# Altium schematic sheet Page04 CPU PWR.SchDoc
size 513 x 386 mm
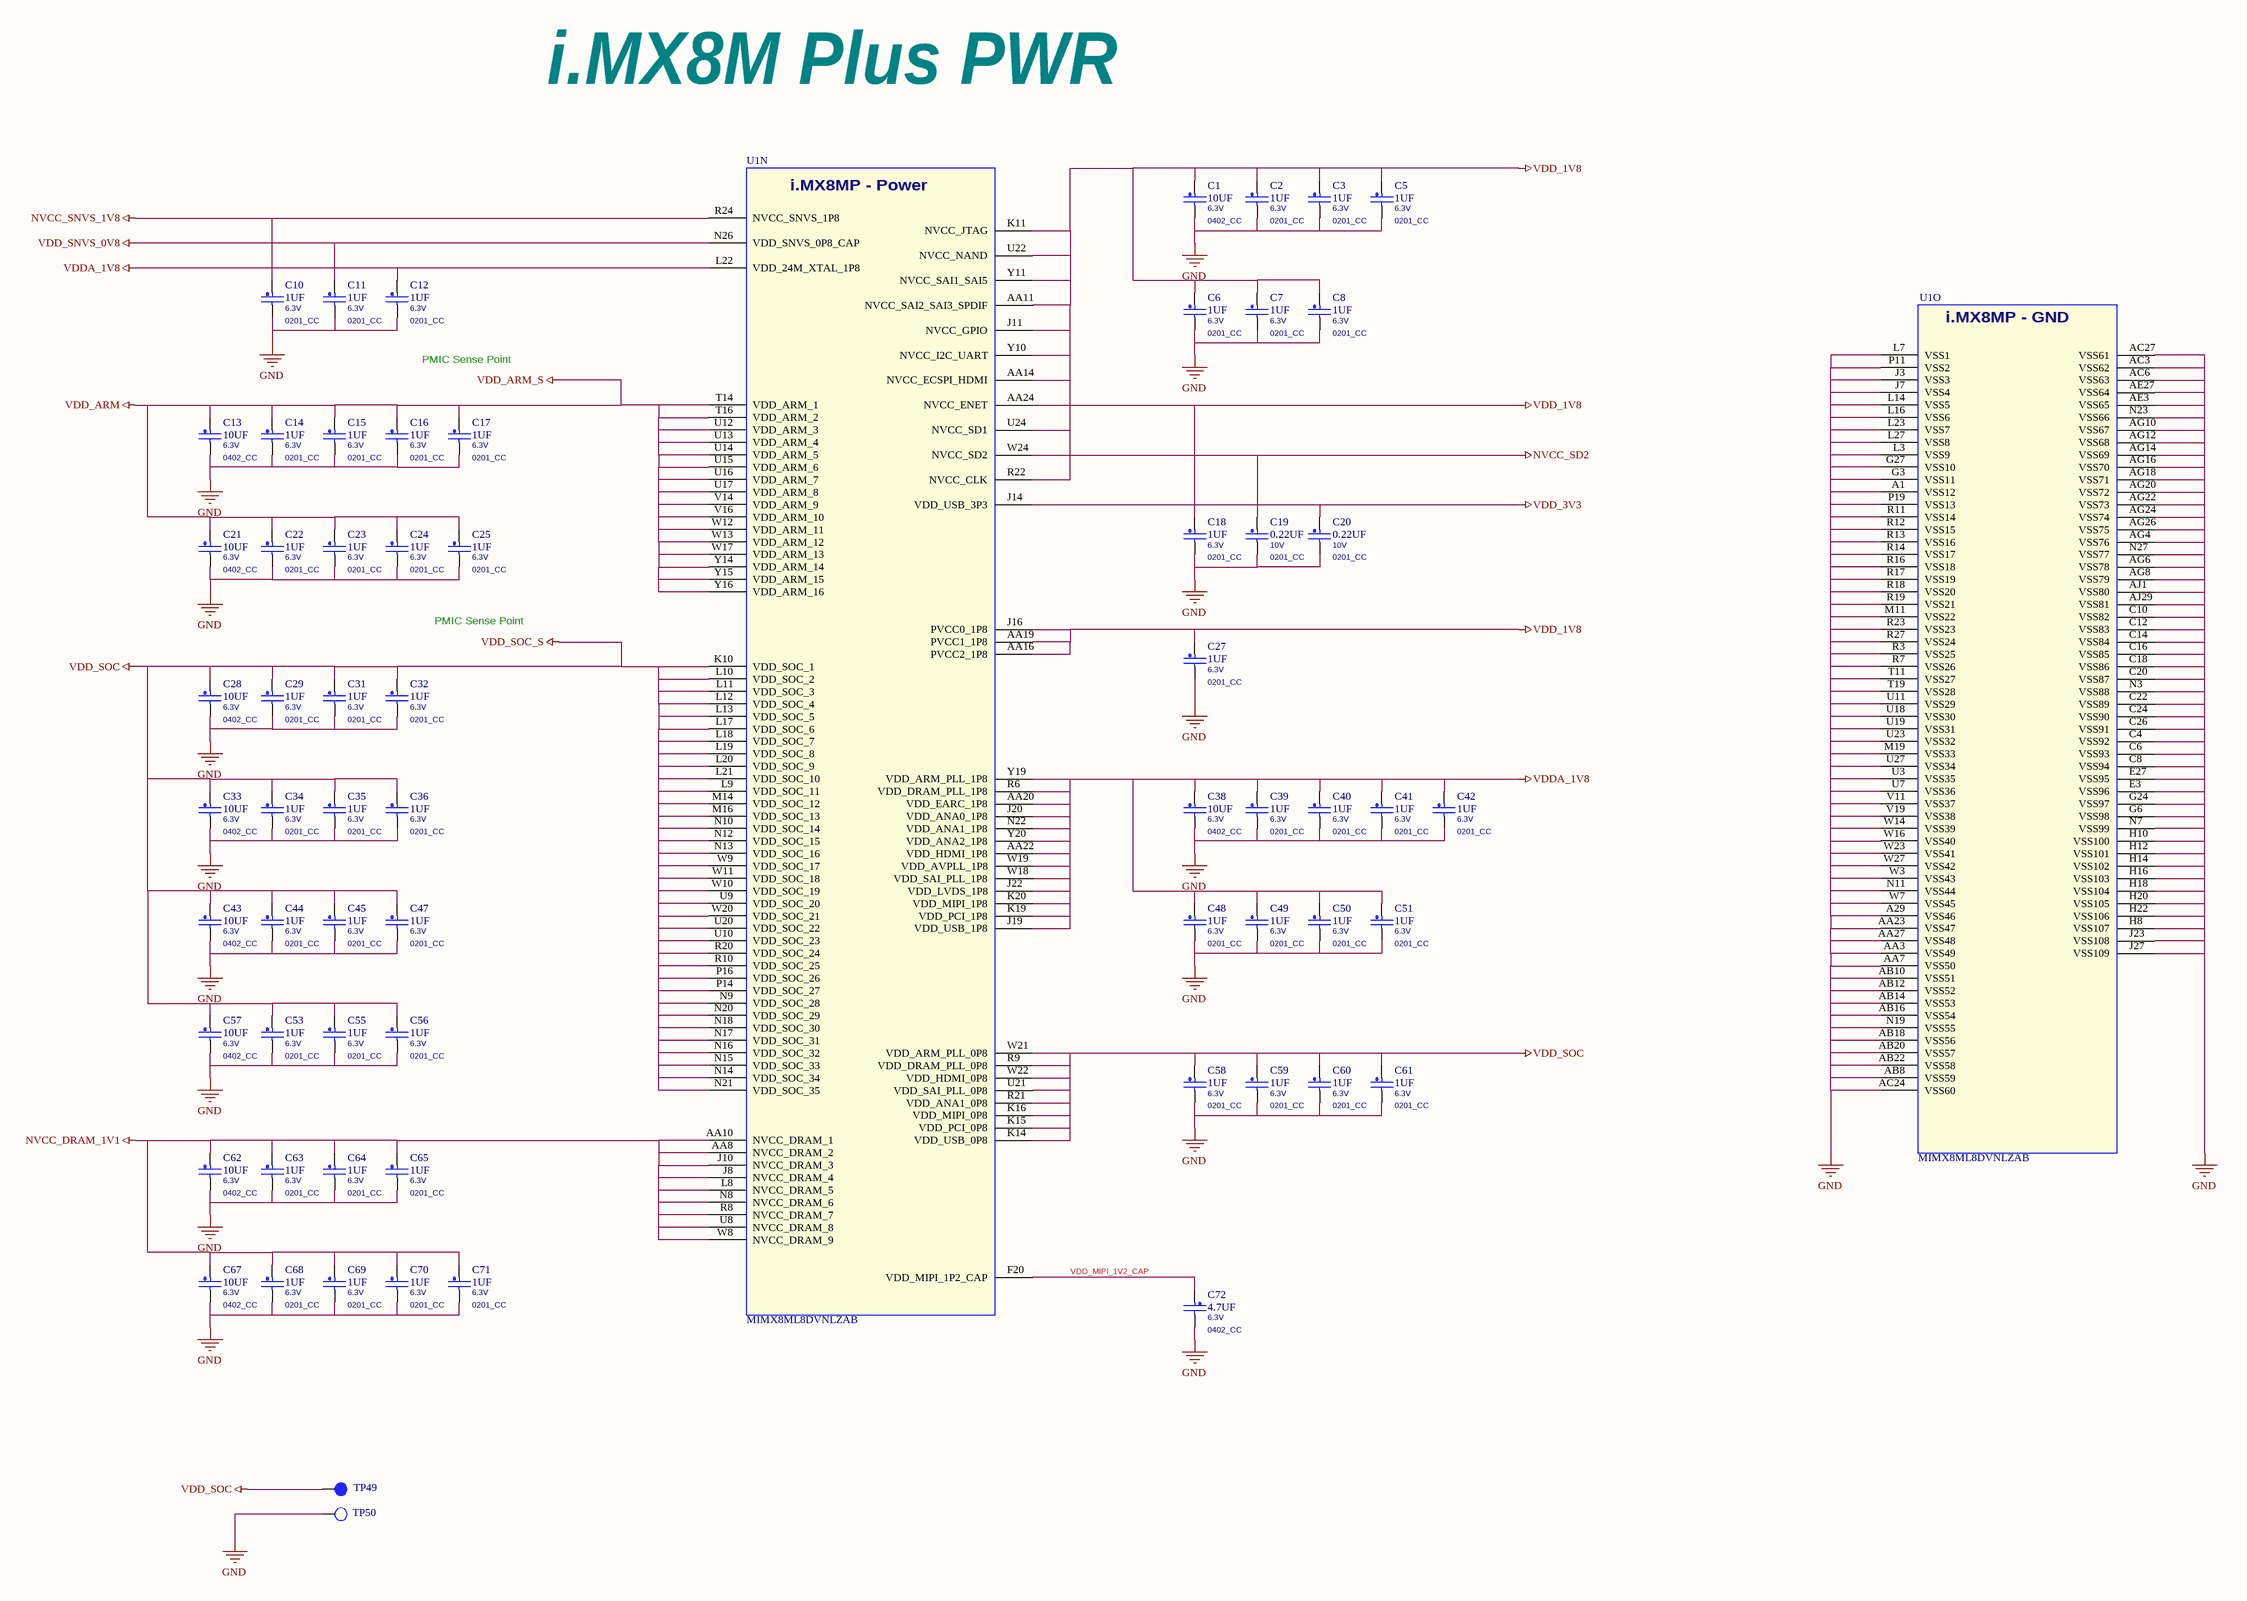
[diagram p0: Page04 CPU PWR.SchDoc]

## Parts
C1  10UF  VOLTAGE: 6.3V  [0402_CC]
C2  1UF  VOLTAGE: 6.3V  [0201_CC]
C3  1UF  VOLTAGE: 6.3V  [0201_CC]
C5  1UF  VOLTAGE: 6.3V  [0201_CC]
C6  1UF  VOLTAGE: 6.3V  [0201_CC]
C7  1UF  VOLTAGE: 6.3V  [0201_CC]
C8  1UF  VOLTAGE: 6.3V  [0201_CC]
C10  1UF  VOLTAGE: 6.3V  [0201_CC]
C11  1UF  VOLTAGE: 6.3V  [0201_CC]
C12  1UF  VOLTAGE: 6.3V  [0201_CC]
C13  10UF  VOLTAGE: 6.3V  [0402_CC]
C14  1UF  VOLTAGE: 6.3V  [0201_CC]
C15  1UF  VOLTAGE: 6.3V  [0201_CC]
C16  1UF  VOLTAGE: 6.3V  [0201_CC]
C17  1UF  VOLTAGE: 6.3V  [0201_CC]
C18  1UF  VOLTAGE: 6.3V  [0201_CC]
C19  0.22UF  VOLTAGE: 10V  [0201_CC]
C20  0.22UF  VOLTAGE: 10V  [0201_CC]
C21  10UF  VOLTAGE: 6.3V  [0402_CC]
C22  1UF  VOLTAGE: 6.3V  [0201_CC]
C23  1UF  VOLTAGE: 6.3V  [0201_CC]
C24  1UF  VOLTAGE: 6.3V  [0201_CC]
C25  1UF  VOLTAGE: 6.3V  [0201_CC]
C27  1UF  VOLTAGE: 6.3V  [0201_CC]
C28  10UF  VOLTAGE: 6.3V  [0402_CC]
C29  1UF  VOLTAGE: 6.3V  [0201_CC]
C31  1UF  VOLTAGE: 6.3V  [0201_CC]
C32  1UF  VOLTAGE: 6.3V  [0201_CC]
C33  10UF  VOLTAGE: 6.3V  [0402_CC]
C34  1UF  VOLTAGE: 6.3V  [0201_CC]
C35  1UF  VOLTAGE: 6.3V  [0201_CC]
C36  1UF  VOLTAGE: 6.3V  [0201_CC]
C38  10UF  VOLTAGE: 6.3V  [0402_CC]
C39  1UF  VOLTAGE: 6.3V  [0201_CC]
C40  1UF  VOLTAGE: 6.3V  [0201_CC]
C41  1UF  VOLTAGE: 6.3V  [0201_CC]
C42  1UF  VOLTAGE: 6.3V  [0201_CC]
C43  10UF  VOLTAGE: 6.3V  [0402_CC]
C44  1UF  VOLTAGE: 6.3V  [0201_CC]
C45  1UF  VOLTAGE: 6.3V  [0201_CC]
C47  1UF  VOLTAGE: 6.3V  [0201_CC]
C48  1UF  VOLTAGE: 6.3V  [0201_CC]
C49  1UF  VOLTAGE: 6.3V  [0201_CC]
C50  1UF  VOLTAGE: 6.3V  [0201_CC]
C51  1UF  VOLTAGE: 6.3V  [0201_CC]
C53  1UF  VOLTAGE: 6.3V  [0201_CC]
C55  1UF  VOLTAGE: 6.3V  [0201_CC]
C56  1UF  VOLTAGE: 6.3V  [0201_CC]
C57  10UF  VOLTAGE: 6.3V  [0402_CC]
C58  1UF  VOLTAGE: 6.3V  [0201_CC]
C59  1UF  VOLTAGE: 6.3V  [0201_CC]
C60  1UF  VOLTAGE: 6.3V  [0201_CC]
C61  1UF  VOLTAGE: 6.3V  [0201_CC]
C62  10UF  VOLTAGE: 6.3V  [0402_CC]
C63  1UF  VOLTAGE: 6.3V  [0201_CC]
C64  1UF  VOLTAGE: 6.3V  [0201_CC]
C65  1UF  VOLTAGE: 6.3V  [0201_CC]
C67  10UF  VOLTAGE: 6.3V  [0402_CC]
C68  1UF  VOLTAGE: 6.3V  [0201_CC]
C69  1UF  VOLTAGE: 6.3V  [0201_CC]
C70  1UF  VOLTAGE: 6.3V  [0201_CC]
C71  1UF  VOLTAGE: 6.3V  [0201_CC]
C72  4.7UF  voltage rating: 6.3V  [0402_CC]
TP49  tpad_020  [tpad_020]  (value not drawn)
TP50  TP_35MIL  [testpoint_35mil]  (value not drawn)
U1  MIMX8ML8DVNLZAB  [BGA_M865S_0P5_15X15-BMS]  (parts N,O of 15)

## Nets
GND: C1.2 C2.2 C3.2 C5.2 C6.2 C7.2 C8.2 C10.2 C11.2 C12.2 C13.2 C14.2 C15.2 C16.2 C17.2 C18.2 C19.2 C20.2 C21.2 C22.2 C23.2 C24.2 C25.2 C27.2 C28.2 C29.2 C31.2 C32.2 C33.2 C34.2 C35.2 C36.2 C38.2 C39.2 C40.2 C41.2 C42.2 C43.2 C44.2 C45.2 C47.2 C48.2 C49.2 C50.2 C51.2 C53.2 C55.2 C56.2 C57.2 C58.2 C59.2 C60.2 C61.2 C62.2 C63.2 C64.2 C65.2 C67.2 C68.2 C69.2 C70.2 C71.2 C72.2 TP50.1(TP) U1.A1(VSS12) U1.A29(VSS46) U1.AA3(VSS49) U1.AA7(VSS50) U1.AA23(VSS47) U1.AA27(VSS48) U1.AB8(VSS59) U1.AB10(VSS51) U1.AB12(VSS52) U1.AB14(VSS53) U1.AB16(VSS54) U1.AB18(VSS56) U1.AB20(VSS57) U1.AB22(VSS58) U1.AC3(VSS62) U1.AC6(VSS63) U1.AC24(VSS60) U1.AC27(VSS61) U1.AE3(VSS65) U1.AE27(VSS64) U1.AG4(VSS76) U1.AG6(VSS78) U1.AG8(VSS79) U1.AG10(VSS67) U1.AG12(VSS68) U1.AG14(VSS69) U1.AG16(VSS70) U1.AG18(VSS71) U1.AG20(VSS72) U1.AG22(VSS73) U1.AG24(VSS74) U1.AG26(VSS75) U1.AJ1(VSS80) U1.AJ29(VSS81) U1.C4(VSS92) U1.C6(VSS93) U1.C8(VSS94) U1.C10(VSS82) U1.C12(VSS83) U1.C14(VSS84) U1.C16(VSS85) U1.C18(VSS86) U1.C20(VSS87) U1.C22(VSS89) U1.C24(VSS90) U1.C26(VSS91) U1.E3(VSS96) U1.E27(VSS95) U1.G3(VSS11) U1.G6(VSS98) U1.G24(VSS97) U1.G27(VSS10) U1.H8(VSS107) U1.H10(VSS100) U1.H12(VSS101) U1.H14(VSS102) U1.H16(VSS103) U1.H18(VSS104) U1.H20(VSS105) U1.H22(VSS106) U1.J3(VSS3) U1.J7(VSS4) U1.J23(VSS108) U1.J27(VSS109) U1.L3(VSS9) U1.L7(VSS1) U1.L14(VSS5) U1.L16(VSS6) U1.L23(VSS7) U1.L27(VSS8) U1.M11(VSS22) U1.M19(VSS33) U1.N3(VSS88) U1.N7(VSS99) U1.N11(VSS44) U1.N19(VSS55) U1.N23(VSS66) U1.N27(VSS77) U1.P11(VSS2) U1.P19(VSS13) U1.R3(VSS25) U1.R7(VSS26) U1.R11(VSS14) U1.R12(VSS15) U1.R13(VSS16) U1.R14(VSS17) U1.R16(VSS18) U1.R17(VSS19) U1.R18(VSS20) U1.R19(VSS21) U1.R23(VSS23) U1.R27(VSS24) U1.T11(VSS27) U1.T19(VSS28) U1.U3(VSS35) U1.U7(VSS36) U1.U11(VSS29) U1.U18(VSS30) U1.U19(VSS31) U1.U23(VSS32) U1.U27(VSS34) U1.V11(VSS37) U1.V19(VSS38) U1.W3(VSS43) U1.W7(VSS45) U1.W14(VSS39) U1.W16(VSS40) U1.W23(VSS41) U1.W27(VSS42)
NVCC_DRAM_1V1: C62.1 C63.1 C64.1 C65.1 C67.1 C68.1 C69.1 C70.1 C71.1 U1.AA8(NVCC_DRAM_2) U1.AA10(NVCC_DRAM_1) U1.J8(NVCC_DRAM_4) U1.J10(NVCC_DRAM_3) U1.L8(NVCC_DRAM_5) U1.N8(NVCC_DRAM_6) U1.R8(NVCC_DRAM_7) U1.U8(NVCC_DRAM_8) U1.W8(NVCC_DRAM_9)
NVCC_SD2: C19.1 U1.W24(NVCC_SD2)
NVCC_SNVS_1V8: C10.1 U1.R24(NVCC_SNVS_1P8)
VDD_1V8: C1.1 C2.1 C3.1 C5.1 C6.1 C7.1 C8.1 C18.1 C27.1 U1.AA11(NVCC_SAI2_SAI3_SPDIF) U1.AA14(NVCC_ECSPI_HDMI) U1.AA16(PVCC2_1P8) U1.AA19(PVCC1_1P8) U1.AA24(NVCC_ENET) U1.J11(NVCC_GPIO) U1.J16(PVCC0_1P8) U1.K11(NVCC_JTAG) U1.R22(NVCC_CLK) U1.U22(NVCC_NAND) U1.U24(NVCC_SD1) U1.Y10(NVCC_I2C_UART) U1.Y11(NVCC_SAI1_SAI5)
VDD_3V3: C20.1 U1.J14(VDD_USB_3P3)
VDD_ARM: C13.1 C14.1 C15.1 C16.1 C17.1 C21.1 C22.1 C23.1 C24.1 C25.1 U1.T14(VDD_ARM_1) U1.T16(VDD_ARM_2) U1.U12(VDD_ARM_3) U1.U13(VDD_ARM_4) U1.U14(VDD_ARM_5) U1.U15(VDD_ARM_6) U1.U16(VDD_ARM_7) U1.U17(VDD_ARM_8) U1.V14(VDD_ARM_9) U1.V16(VDD_ARM_10) U1.W12(VDD_ARM_11) U1.W13(VDD_ARM_12) U1.W17(VDD_ARM_13) U1.Y14(VDD_ARM_14) U1.Y15(VDD_ARM_15) U1.Y16(VDD_ARM_16)  [also labelled VDD_ARM_S]
VDD_SNVS_0V8: C11.1 U1.N26(VDD_SNVS_0P8_CAP)
VDD_SOC: C28.1 C29.1 C31.1 C32.1 C33.1 C34.1 C35.1 C36.1 C43.1 C44.1 C45.1 C47.1 C53.1 C55.1 C56.1 C57.1 C58.1 C59.1 C60.1 C61.1 TP49.1(Pin1) U1.K10(VDD_SOC_1) U1.K14(VDD_USB_0P8) U1.K15(VDD_PCI_0P8) U1.K16(VDD_MIPI_0P8) U1.L9(VDD_SOC_11) U1.L10(VDD_SOC_2) U1.L11(VDD_SOC_3) U1.L12(VDD_SOC_4) U1.L13(VDD_SOC_5) U1.L17(VDD_SOC_6) U1.L18(VDD_SOC_7) U1.L19(VDD_SOC_8) U1.L20(VDD_SOC_9) U1.L21(VDD_SOC_10) U1.M14(VDD_SOC_12) U1.M16(VDD_SOC_13) U1.N9(VDD_SOC_28) U1.N10(VDD_SOC_14) U1.N12(VDD_SOC_15) U1.N13(VDD_SOC_16) U1.N14(VDD_SOC_34) U1.N15(VDD_SOC_33) U1.N16(VDD_SOC_32) U1.N17(VDD_SOC_31) U1.N18(VDD_SOC_30) U1.N20(VDD_SOC_29) U1.N21(VDD_SOC_35) U1.P14(VDD_SOC_27) U1.P16(VDD_SOC_26) U1.R9(VDD_DRAM_PLL_0P8) U1.R10(VDD_SOC_25) U1.R20(VDD_SOC_24) U1.R21(VDD_ANA1_0P8) U1.U9(VDD_SOC_20) U1.U10(VDD_SOC_23) U1.U20(VDD_SOC_22) U1.U21(VDD_SAI_PLL_0P8) U1.W9(VDD_SOC_17) U1.W10(VDD_SOC_19) U1.W11(VDD_SOC_18) U1.W20(VDD_SOC_21) U1.W21(VDD_ARM_PLL_0P8) U1.W22(VDD_HDMI_0P8)  [also labelled VDD_SOC_S]
VDDA_1V8: C12.1 C38.1 C39.1 C40.1 C41.1 C42.1 C48.1 C49.1 C50.1 C51.1 U1.AA20(VDD_EARC_1P8) U1.AA22(VDD_HDMI_1P8) U1.J19(VDD_USB_1P8) U1.J20(VDD_ANA0_1P8) U1.J22(VDD_LVDS_1P8) U1.K19(VDD_PCI_1P8) U1.K20(VDD_MIPI_1P8) U1.L22(VDD_24M_XTAL_1P8) U1.N22(VDD_ANA1_1P8) U1.R6(VDD_DRAM_PLL_1P8) U1.W18(VDD_SAI_PLL_1P8) U1.W19(VDD_AVPLL_1P8) U1.Y19(VDD_ARM_PLL_1P8) U1.Y20(VDD_ANA2_1P8)
VDD_MIPI_1V2_CAP: C72.1 U1.F20(VDD_MIPI_1P2_CAP)

## Notes on the sheet
- i.MX8M Plus PWR
- PMIC Sense Point
- (in symbol MIMX8MP_BGA548, part N) i.MX8MP - Power
- (in symbol MIMX8MP_BGA548, part O) i.MX8MP - GND

## Library data of the parts
C1 C38 C43 C57 C62 = CAP_NP: CAP CER 10UF 6.3V 20% X5R 0402; CLASS: DISCRETE; FPLIST: CC0402_25,CC0402_HD,0402_CC; CAD_APPROVED: Yes; MFG_PN01: CL05A106MQ5NUNC; MFG_NAME01: SAMSUNG ELECTRO MECHANICS; AGILE_PN: 150-79163; HEIGHT: 0.65 MM; ROHS: Yes; Tolerance: 20%; PCB Footprint: 0402_CC
C2 C5 C11 C12 C14-C18 C22-C25 C31 C34 C36 C39 C41 C42 C45 C49 C53 C56 C58 C60 C61 C68-C70 = CAP_NP: CAP CER 1uF 6.3V 20% X5R 0201; CLASS: DISCRETE; AGILE_PN: 150-79407; MFG_NAME01: AVX; MFG_PN01: 02016D105MAT2A; CAD_APPROVED: Yes; FPLIST: CC0201,CC0201_HD,0201_CC,0201_CC_012SM_NSP; Tolerance: 20%; ROHS: Yes; HEIGHT: 0.35MM; PCB Footprint: 0201_CC; Package Size: 0201; Package Type: 7¡± reel
C3 C6-C8 C10 C27 C29 C32 C35 C40 C44 C47 C48 C50 C51 C55 C59 C63-C65 C71 = CAP_NP: CAP CER 1uF 6.3V 20% X5R 0201; CLASS: DISCRETE; FPLIST: CC0201,CC0201_HD,0201_CC,0201_CC_012SM_NSP; CAD_APPROVED: Yes; MFG_PN01: 02016D105MAT2A; MFG_NAME01: AVX; AGILE_PN: 150-79407; HEIGHT: 0.35MM; ROHS: Yes; Tolerance: 20%; PCB Footprint: 0201_CC; Package Size: 0201; Package Type: 7¡± reel
C13 C21 C28 C33 C67 = CAP_NP: CAP CER 10UF 6.3V 20% X5R 0402; CLASS: DISCRETE; AGILE_PN: 150-79163; MFG_NAME01: SAMSUNG ELECTRO MECHANICS; MFG_PN01: CL05A106MQ5NUNC; CAD_APPROVED: Yes; FPLIST: CC0402_25,CC0402_HD,0402_CC; Tolerance: 20%; ROHS: Yes; HEIGHT: 0.65 MM; PCB Footprint: 0402_CC
C19 = CAP_NP: CAP CER 0.22UF 10V 20% X5R 0201; CLASS: DISCRETE; AGILE_PN: 150-78815; MFG_NAME01: Taiyo Yuden; MFG_PN01: LMK063BJ224MP-F; CAD_APPROVED: Yes; FPLIST: CC0201,CC0201_HD,0201_CC; Tolerance: 20%; ROHS: Yes; HEIGHT: 0.33MM; PCB Footprint: 0201_CC
C20 = CAP_NP: CAP CER 0.22UF 10V 20% X5R 0201; CLASS: DISCRETE; FPLIST: CC0201,CC0201_HD,0201_CC; CAD_APPROVED: Yes; MFG_PN01: LMK063BJ224MP-F; MFG_NAME01: Taiyo Yuden; AGILE_PN: 150-78815; HEIGHT: 0.33MM; ROHS: Yes; Tolerance: 20%; PCB Footprint: 0201_CC
C72 = CAP_NP: CAP CER 4.7UF 6.3V 20% X5R 0402; CLASS: DISCRETE; AGILE_PN: 150-78463; MFG_NAME01: TDK; MFG_PN01: C1005X5R0J475M050BC; CAD_APPROVED: Yes; FPLIST: CC0402_25,CC0402_HD,0402_CC; VOLTAGE: 6.3V; Tolerance: 20%; ROHS: Yes; HEIGHT: 0.65MM; PCB Footprint: 0402_CC
TP49 = TESTLOOP: TEST POINT PAD 0.5MM DIA SMT, NO PART TO ORDER; ASSY_OPT: DNP; CLASS: IO; AGILE_PN: 211-77484; CAD_APPROVED: Yes; ROHS: Yes; HEIGHT: 0.1MM; PCB Footprint: tpad_020
TP50 = T POINT R: TEST POINT PAD .035 SMT, no part to order; CLASS: IC; ASSY_OPT: DNP; AGILE_PN: 510-75618; CAD_APPROVED: Yes; ROHS: Yes; HEIGHT: 0.1MM; PCB Footprint: testpoint_35mil
U1 = MIMX8MP_BGA548: IC CPU QUAD CORTEX A53+M4 1.8GHZ BGA548; SPLIT_INST: TRUE; PCB Footprint: bga548_0p5_15x15mm; CAD_APPROVED: Yes; MFG_NAME01: NXP SEMICONDUCTORS; AGILE_PN: 330-77126; CLASS: IC; HEIGHT: 2.1MM; MFG_PN01: MIMX8ML8DVNLZAB